# EAGLE design AK-CMSIS-DAP_V1.3 (EAGLE 7.6.0)
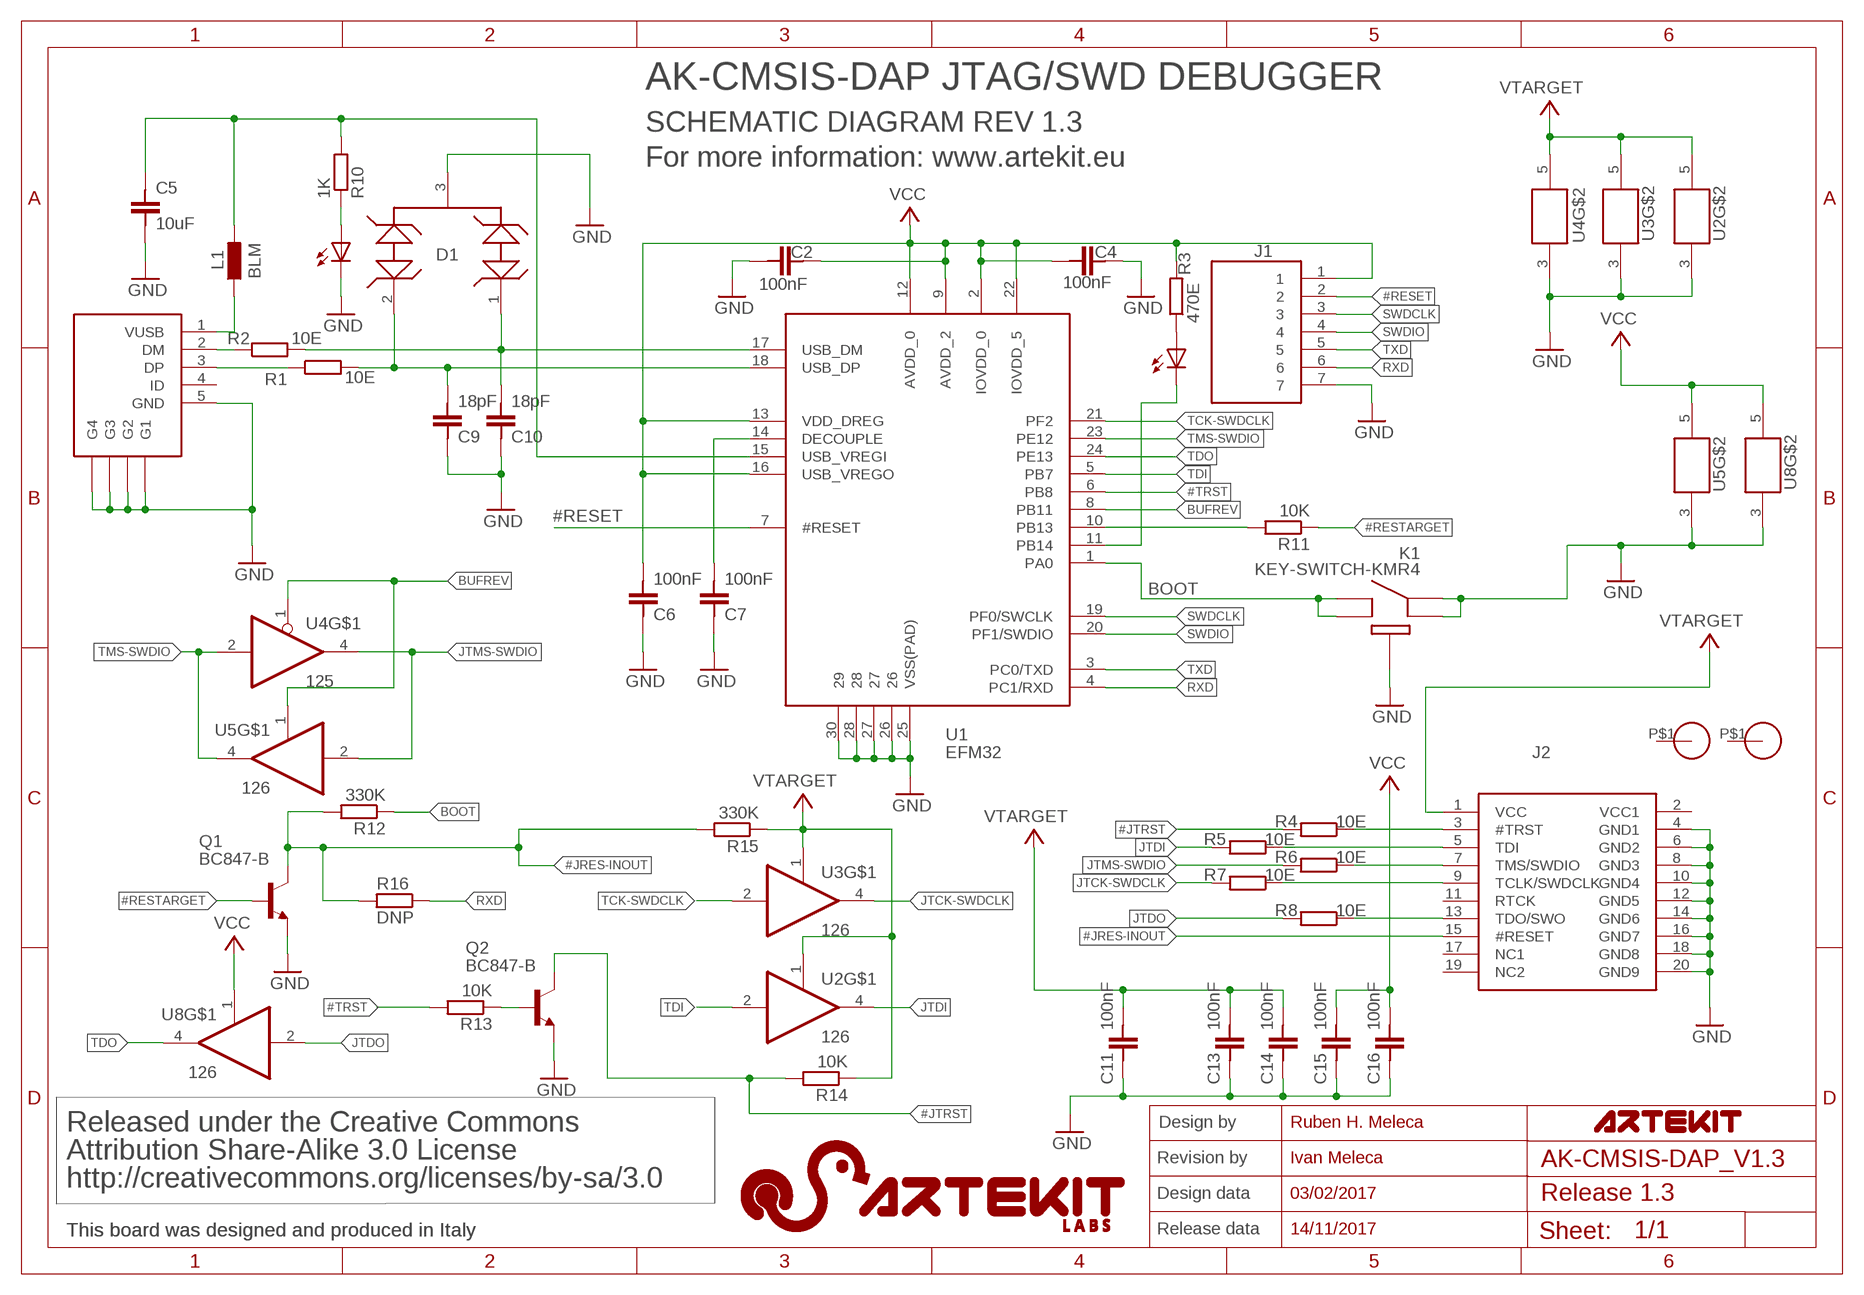
[diagram p0: schematic, sheet 1]

## Parts
C2  100nF  C0603  [C0603]
C4  100nF  C0603  [C0603]
C5  10uF  C0805  [C0805]
C6  100nF  C0603  [C0603]
C7  100nF  C0603  [C0603]
C9  18pF  C0603  [C0603]
C10  18pF  C0603  [C0603]
C11  100nF  C0603  [C0603]
C13  100nF  C0603  [C0603]
C14  100nF  C0603  [C0603]
C15  100nF  C0603  [C0603]
C16  100nF  C0603  [C0603]
D1  D5V0L  D5V0L2B3SO-71  [SOT-23-3]
J1  CON-PH-1X07-P0.1"1  [PIN-HEADER-1X07]
J2  CONN-JTAG-20PIN-SMD  [PIN-HEADER-2X10-WURTH]
K1  KEY-SWITCH-KMR4  [KEY-SWITCH-KMR-SERIES]
L1  BLM  BLM18HD601SN1  [I0603]
Q1  BC847-B  [SOT-23-3]
Q2  BC847-B  [SOT-23-3]
R1  10E  R0603  [R0603]
R2  10E  R0603  [R0603]
R3  470E  R0603  [R0603]
R4  10E  R0603  [R0603]
R5  10E  R0603  [R0603]
R6  10E  R0603  [R0603]
R7  10E  R0603  [R0603]
R8  10E  R0603  [R0603]
R10  1K  R0603  [R0603]
R11  10K  R0603  [R0603]
R12  330K  R0603  [R0603]
R13  10K  R0603  [R0603]
R14  10K  R0603  [R0603]
R15  330K  R0603  [R0603]
R16  DNP  R0603  [R0603]
U1  EFM32  EFM32HG308F64G-A-QFN241  [QFN24-5X5-P0.65]
U2  126  74LVC1G126SOT363-5  [SOT363-5]
U3  126  74LVC1G126SOT363-5  [SOT363-5]
U4  125  74LVC1G125SOT363-5  [SOT363-5]
U5  126  74LVC1G126SOT363-5  [SOT363-5]
U8  126  74LVC1G126SOT363-5  [SOT363-5]
U$1  CON-USB-MINI-B-SMD  [CON-USB-MINI-B-SMD]
U$2  LED0603-RED  [CHIPLED_0603]
U$3  FIDUTIAL_1.2MM  [FIDUTIAL_1.2MM]
U$4  LED0603-RED  [CHIPLED_0603]
U$5  FIDUTIAL_1.2MM  [FIDUTIAL_1.2MM]

## Nets
#JRES-INOUT: J2.15(#RESET) Q1.3 R12.2 R15.2 R16.2
#JTRST: Q2.3 R4.2 R14.2
#RESET: J1.2 U1.7(#RESET)
#RESTARGET: Q1.1 R11.1
#TRST: R13.2 U1.6(PB8)
BOOT: K1.3 K1.4 R12.1 U1.1(PA0)
BUFREV: U1.8(PB11) U4.1(EN) U5.1(EN)
GND: C2.1 C4.2 C5.2 C6.1 C7.1 C9.1 C10.1 C11.1 C13.1 C14.1 C15.1 C16.1 D1.3 J1.7 J2.4(GND1) J2.6(GND2) J2.8(GND3) J2.10(GND4) J2.12(GND5) J2.14(GND6) J2.16(GND7) J2.18(GND8) J2.20(GND9) K1.1 K1.2 K1.5 Q1.2 Q2.2 U1.25(VSS(PAD)) U1.26 U1.27 U1.28 U1.30 U2.3(GND) U3.3(GND) U4.3(GND) U5.3(GND) U8.3(GND) U$1.5(GND) U$1.C(G1) U$1.D(G2) U$1.E(G3) U$1.F(G4) U$2.C
JTCK-SWDCLK: R7.2 U3.4(O)
JTDI: R5.2 U2.4(O)
JTDO: R8.2 U8.2(I)
JTMS-SWDIO: R6.2 U4.4(O) U5.2(I)
N$1: R2.1 U$1.2(DM)
N$2: R1.1 U$1.3(DP)
N$3: C10.2 D1.1 R2.2 U1.17(USB_DM)
N$4: C9.2 D1.2 R1.2 U1.18(USB_DP)
N$5: L1.1 U$1.1(VUSB)
N$6: C5.1 L1.2 R10.2 U1.15(USB_VREGI)
N$7: C7.2 U1.14(DECOUPLE)
N$8: J2.3(#TRST) R4.1
N$9: R3.1 U$4.A
N$10: J2.5(TDI) R5.1
N$11: U1.11(PB14) U$4.C
N$12: J2.7(TMS/SWDIO) R6.1
N$13: J2.9(TCLK/SWDCLK) R7.1
N$14: J2.13(TDO/SWO) R8.1
N$16: R10.1 U$2.A
N$17: R11.2 U1.10(PB13)
N$18: Q2.1 R13.1
RXD: J1.6 R16.1 U1.4(PC1/RXD)
SWDCLK: J1.3 U1.19(PF0/SWCLK)
SWDIO: J1.4 U1.20(PF1/SWDIO)
TCK-SWDCLK: U1.21(PF2) U3.2(I)
TDI: U1.5(PB7) U2.2(I)
TDO: U1.24(PE13) U8.4(O)
TMS-SWDIO: U1.23(PE12) U4.2(I) U5.4(O)
TXD: J1.5 U1.3(PC0/TXD)
VCC: C2.2 C4.1 C6.2 C15.2 C16.2 J1.1 R3.2 U1.2(IOVDD_0) U1.9(AVDD_2) U1.12(AVDD_0) U1.13(VDD_DREG) U1.16(USB_VREGO) U1.22(IOVDD_5) U5.5(VCC) U8.1(EN) U8.5(VCC)
VTARGET: C11.2 C13.2 C14.2 J2.1(VCC) R14.1 R15.1 U2.1(EN) U2.5(VCC) U3.1(EN) U3.5(VCC) U4.5(VCC)
Unconnected: J2.2(VCC1) J2.11(RTCK) J2.17(NC1) J2.19(NC2) U$1.4(ID) U$3.P$1 U$5.P$1

## Notes on the sheet
- AK-CMSIS-DAP JTAG/SWD DEBUGGER
- SCHEMATIC DIAGRAM REV 1.3
- For more information: www.artekit.eu
- Released under the Creative Commons | Design by | Ruben H. Meleca
- Attribution Share-Alike 3.0 License | Revision by | Ivan Meleca
- http://creativecommons.org/licenses/by-sa/3.0
- Design data | 03/02/2017 | Release 1.3
- This board was designed and produced in Italy | This board was designed and produced in Italy | Release data | 14/11/2017

## Library data of the parts
C2 C4 C6 C7 C9-C11 C13-C16 = ak:C0603: CAP SMD 0603 NP; MF: unknown; MPN: unknown
C5 = ak:C0805: CAP SMD 0805 NP; MF: unknown; MPN: unknown
D1 = ak:D5V0L2B3SO-7: TVS Diode 5V Bidir SOT23-5
J1 = ak:CON-PH-1X07-P0.1": CON-Pin Header 1x07 Pitch 0.1"
J2 = ak:CONN-JTAG-20PIN-SMD: JTAG Connector 20-pin P2.54 Right Angle - SMD
K1 = artekit:KEY-SWITCH-KMR4: Key Switch KMR4 series 2.5mm x 4.6mm</b?; MF: C&K Components; MPN: KMR442G ULC LFS; OC_MOUSER: 611-KMR442GULCLFS
L1 = ak:BLM18HD601SN1: EMI Filter Beads, Chips & Arrays 0603 600 OHM; MF: Murata; MPN: BLM18HD601SN1D; OC_MOUSER: 81-BLM11HB601SD
Q1 Q2 = artekit:BC847-B: NPN Bipolar Transistors - 100mA 50V; MF: ON Semiconductors; MPN: BC847BLT1G; OC-DIGIKEY: BC847BLT1GOSCT-ND; OC_FARNELL: 1653607; OC_MOUSER: 863-BC847BLT1G
R1-R8 R10-R15 = ak:R0603: RES SMD 0603; MF: unknown; MPN: unknown
R16 = ak:R0603: RES SMD 0603; ASSY: DNP; MF: unknown; MPN: unknown
U1 = ak:EFM32HG308F64G-A-QFN24: ARM Microcontroller - MCU 64k Flash 8k RAM; MF: Silicon Laboratories; MPN: EFM32HG308F64G-B-QFN24; OC_DIGIKEY: 336-3205-ND; OC_FARNELL: 2475983; OC_MOUSER: 634-EFM32HG308F64GA; OC_NEWARK: 47Y0778; OC_RS: 872-7100
U2 U3 U5 U8 = ak:74LVC1G126: 1 Channel Level Translator & Buffer; MF: Texas; MPN: SN74LVC1G126DCKR; OC_DIGIKEY: 296-11606-1-ND; OC_FARNELL: 2437142; OC_MOUSER: 595-SN74LVC1G126DCKR
U4 = ak:74LVC1G125: 1 Channel Level Translator & Buffer
U$1 = ak:CON-USB-MINI-B-SMD: USB-MINI SMD Connector; MF: EDAC; MPN: 690-005-299-043; OC_MOUSER: 587-690-005-299-043
U$2 U$4 = ak:LED0603-RED: Standard LEDs - SMD Super Red, 633nm 180mcd, 20mA; MF: Osram; MPN: LTST-C191KRKT; OC_DIGIKEY: 475-2512-1-ND; OC_MOUSER: 720-LSQ976-NR-1
U$3 U$5 = artekit:FIDUTIAL_1.2MM

## Net classes
0 default: width 0.2 mm, drill 0.2 mm

## Board
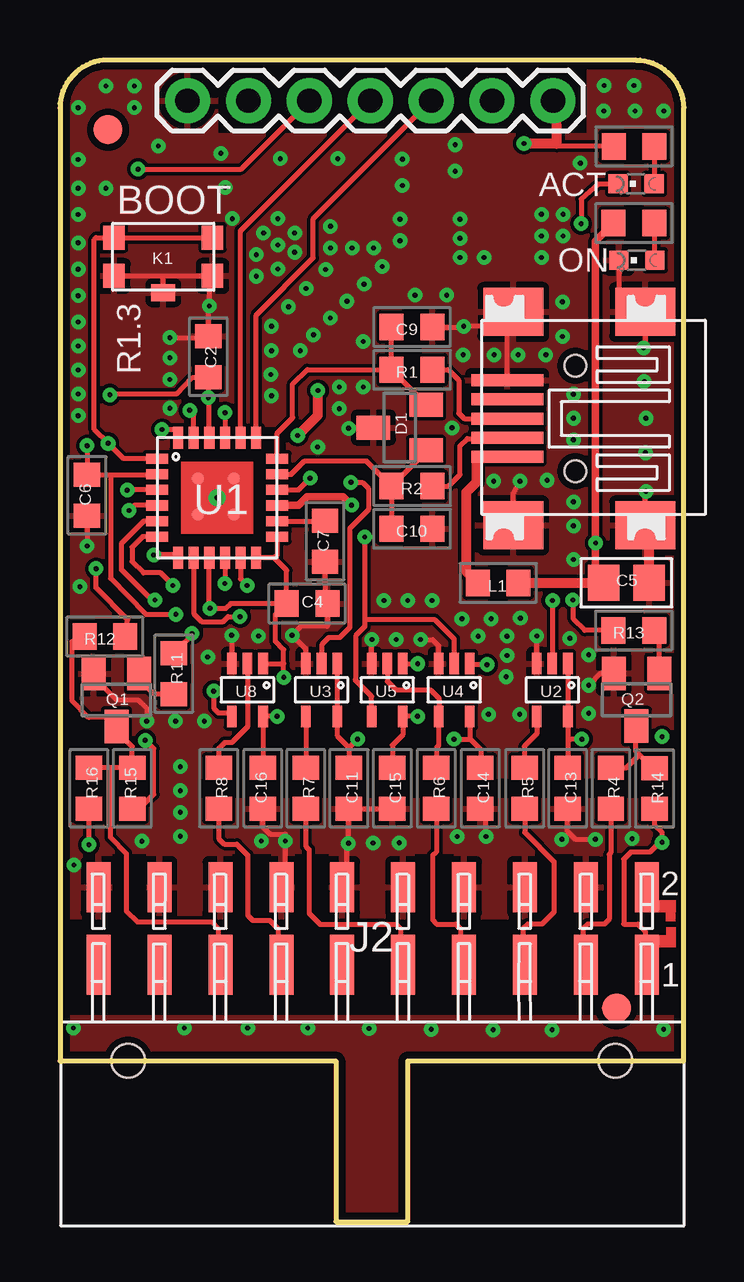
[diagram p1: board, top side]
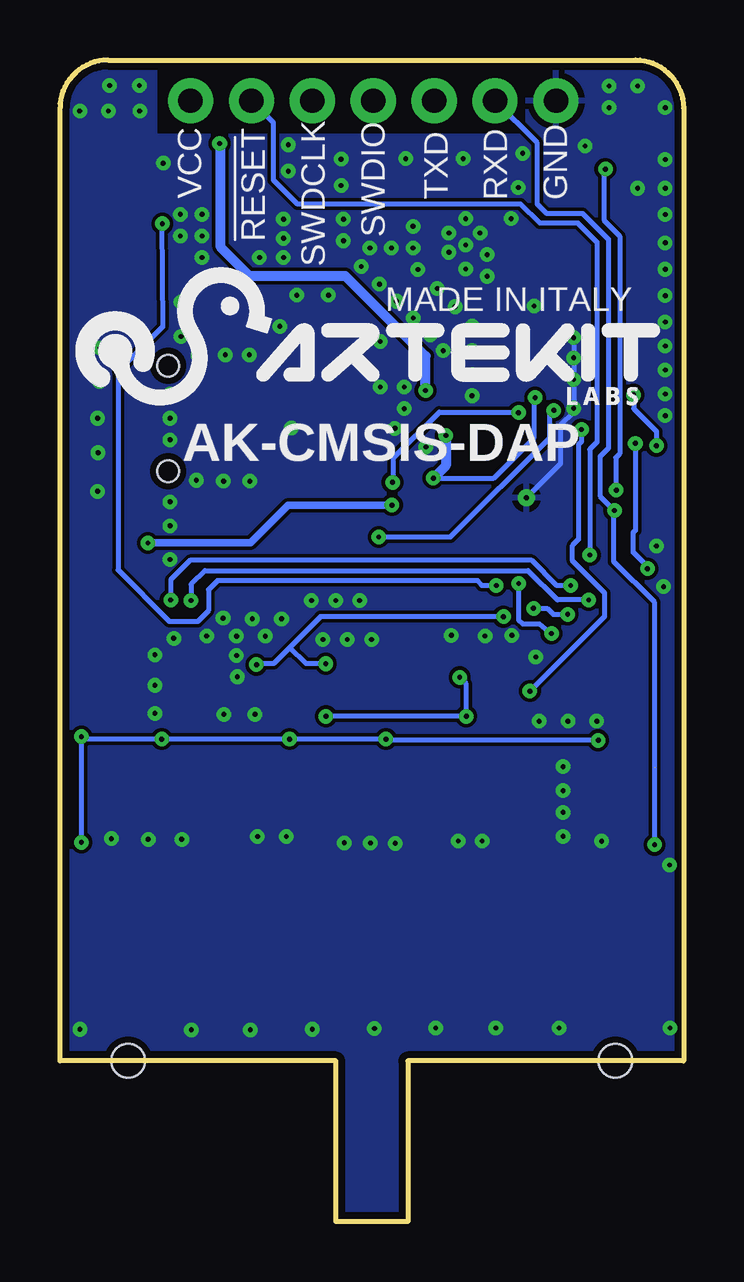
[diagram p2: board, bottom side, seen from below]

Size 26 x 48.4 mm. Coordinates in mm from the lower left corner, seen from the top.
Outline: 0,6.7 11.5,6.7 11.5,0 14.5,0 14.5,6.7 26,6.7 26,46.4 arc90 24,48.4 2,48.4 arc90 0,46.4 0,6.7
Copper layers (1*16): Top 0.035mm / dielectric 1.5mm / Bottom 0.035mm
Design rules "artekit *": minimum track width 0.15mm, minimum drill 0.2mm, track to track 0.15mm, track to pad 0.15mm, pad to pad 0.2mm, via to via 0.15mm, smd to smd 0mil, copper to edge 0.3mm, drill to drill 8mil, minimum pad ring 10mil, minimum via ring 8mil, stop-mask expansion 4mil, vias tented up to drill 15mil, thermal gap 10mil
tRestrict: area 8.4,32.2 to 9.4,33.1; area 6.6,45.4 to 22,48; area 23.6,39.7 to 24.6,40.4; area 0.4,8.6 to 25.6,12.6; area 23.3,12.3 to 25.6,15.3; area 19.8,12.7 to 21.4,15.3; area 14.8,12.7 to 16.4,15.3; area 7.2,12.5 to 8.8,15.3; area 2.2,12.7 to 3.6,15.3; area 9.8,12.5 to 11.2,15.3
bRestrict: area 6.6,45.4 to 21.9,48

### Footprints (pad centres in the part's own frame; a part is rotated, then mirrored left to right if it is on the bottom)
C0603 = smd 1 x 1.1: 1 -0.85,0; 2 0.85,0
C0805 = smd 1.3 x 1.5: 1 -0.99,0; 2 0.91,0
SOT-23-3 = smd 1 x 1.4: 1 -0.95,-1.1; 2 0.95,-1.1; 3 0,1.1
PIN-HEADER-1X07 = drill 1.016 pad 1.88: 1 0,0; 2 2.54,0; 3 5.08,0; 4 7.62,0; 5 10.16,0; 6 12.7,0; 7 15.24,0
PIN-HEADER-2X10-WURTH = smd 1 x 2.5: 1 -11.47,3.13; 3 -8.93,3.13; 5 -6.39,3.13; 7 -3.85,3.13; 9 -1.31,3.13; 11 1.23,3.13; 13 3.77,3.13; 15 6.31,3.13; 17 8.85,3.13; 19 11.39,3.13 | smd 1 x 2.1: 2 -11.47,-0.1; 4 -8.93,-0.1; 6 -6.39,-0.1; 8 -3.85,-0.1; 10 -1.31,-0.1; 12 1.23,-0.1; 14 3.77,-0.1; 16 6.31,-0.1; 18 8.85,-0.1; 20 11.39,-0.1 | hole 1.4: 10.16,7.14; -10.16,7.14
KEY-SWITCH-KMR-SERIES = smd 0.9 x 1: 1 -2.05,0.8; 2 2.05,0.8; 3 2.05,-0.8; 4 -2.05,-0.8 | smd 1 x 0.7: 5 0,1.5
I0603 = smd 1 x 1.1: 1 -0.85,0; 2 0.85,0
R0603 = smd 1 x 1.1: 1 -0.85,0; 2 0.85,0
QFN24-5X5-P0.65 = smd 0.92 x 0.42: 1 -2.5,1.625; 2 -2.5,0.975; 3 -2.5,0.325; 4 -2.5,-0.325; 5 -2.5,-0.975; 6 -2.5,-1.625; 13 2.5,-1.625; 14 2.5,-0.975; 15 2.5,-0.325; 16 2.5,0.325; 17 2.5,0.975; 18 2.5,1.625 | smd 0.42 x 0.92: 7 -1.625,-2.5; 8 -0.975,-2.5; 9 -0.325,-2.5; 10 0.325,-2.5; 11 0.975,-2.5; 12 1.625,-2.5; 19 1.625,2.5; 20 0.975,2.5; 21 0.325,2.5; 22 -0.325,2.5; 23 -0.975,2.5; 24 -1.625,2.5 | smd 0.5 x 0.5: 25 -0.8,0.8; 26 -0.8,-0.7; 27 0.7,-0.7; 28 0.7,0.8 | drill 0.2: 30 0,0
SOT363-5 = smd 0.4 x 0.9: 1 -0.65,-1.1; 2 0,-1.1; 3 0.65,-1.1; 4 0.65,1.1; 5 -0.65,1.1
CON-USB-MINI-B-SMD = smd 0.5 x 3: 1 -1.6,0.25; 2 -0.8,0.25; 3 0,0.25; 4 0.8,0.25; 5 1.6,0.25 | smd 2 x 2.5: C -4.45,0; D 4.45,0; E -4.45,-5.5; F 4.45,-5.5 | hole 0.9: -2.2,-2.6; 2.2,-2.6
CHIPLED_0603 = smd 0.8 x 0.8: A 0,-0.75; C 0,0.75
FIDUTIAL_1.2MM = smd 1.2 x 1.2: P$1 0,0

### Placement (x,y rotation side)
C2  6.19,36.03 270 top
C4  10.3,25.75 0 top
C5  23.65,26.61 0 top
C6  1.13,30.26 90 top
C7  11.05,28.34 90 top
C9  14.68,37.27 180 top
C10  14.68,28.87 180 top
C11  12.05,18.05 90 top
C13  21.17,18.05 90 top
C14  17.53,18.05 90 top
C15  13.86,18.05 90 top
C16  8.46,18.05 90 top
D1  14.17,33.08 90 top
J1  20.56,46.7 180 top
J2  13,13.83 180 top
K1  4.31,40.2 180 top
L1  18.27,26.61 0 top
Q1  2.36,21.73 180 top
Q2  24.04,21.74 180 top
R1  14.68,35.49 180 top
R2  14.68,30.64 180 top
R3  23.94,44.8 180 top
R4  22.97,18.06 90 top
R5  19.38,18.06 90 top
R6  15.69,18.06 90 top
R7  10.25,18.06 90 top
R8  6.62,18.06 90 top
R10  23.93,41.6 180 top
R11  4.75,22.82 90 top
R12  1.88,24.38 180 top
R13  23.93,24.63 180 top
R14  24.79,18.05 90 top
R15  3.02,18.06 90 top
R16  1.21,18.06 90 top
U1  6.55,30.16 0 top
U2  20.53,22.15 180 top
U3  10.91,22.15 180 top
U4  16.44,22.15 180 top
U5  13.65,22.15 180 top
U8  7.82,22.15 180 top
U$1  18.9,33.46 90 top
U$2  24.06,40.05 90 top
U$3  2,45.5 0 top
U$4  24.02,43.24 90 top
U$5  23.2,8.9 0 top

### Tracks (layer width: path | path; a pad name or v marks a point on that pad's centre or on a via)
#JRES-INOUT  (1 unrouted)
  Top 0.2: Q1.3 2.34,20.73 | Q1.3 2.36,21 1.21,21 0.51,21.7 0.51,24.16 R12.2 | Q1.3 2.71,20.38 2.71,20.1 3.02,19.79 R15.2 2.98,18.94 2.01,18.94 | 1.21,18.94 2.01,18.94 | 2.01,18.94 2.11,18.84 2.11,16 2.77,15.34 2.77,12.95 3.23,12.48 6.32,12.48 6.6,12.2 6.6,10.72 J2.15
#JTRST
  Top 0.2: R14.2 24.72,18.9 24.16,19.45 | 24.16,19.45 24.01,19.6 24.01,20.61 Q2.3 | R4.2 23.61,18.91 24.16,19.45
#RESET  (via drill 0.2)
  Top 0.2: U1.7 4.97,27.78 v3.91,27.78
  Bottom 0.2: 3.92,27.7 v3.91,27.78 3.91,32.18 3.61,32.48 3.61,40.81 4.4,41.6 6,41.6 6.8,42.4 16.1,42.4 17.1,43.4 17.1,45.79 J1.2 18,46.69
#RESTARGET
  Top 0.2: Q1.1 3.31,22.6 3.91,22 4.71,22 R11.1
#TRST  (via drill 0.2)
  Top 0.2: U1.6 3.44,28.54 3.01,28.1 3.01,27.5 3.48,27.03 4.21,27.03 4.71,26.53 v4.71,26.5 | R13.2 21.88,24.63 21.41,25.1 21.41,25.88 v21.38,25.9
  Bottom 0.2: v4.71,26.5 5.28,26.5 6.33,27.55 20.58,27.55 21.38,26.75 v21.38,25.9
BOOT  (via drill 0.2)
  Top 0.2: U1.1 2.65,31.79 v2.01,32.43 1.43,33 1.43,40.93 1.51,41 K1.3 K1.4 | R12.1 2.83,25.09 1.51,26.4 v1.51,27.2
  Bottom 0.2: v1.51,27.2 1.51,27.3 2.11,27.9 2.11,28.7 2.01,28.8 v2.01,32.43
BUFREV  (via drill 0.2)
  Top 0.2: U1.8 5.58,25.33 5.91,25 6.81,25 7.01,25.2 v7.51,25.2 | v17.81,23.2 17.14,23.2 U4.1 | U5.1 14.91,23.25 v14.92,23.24
  Bottom 0.2: v7.51,25.2 15.14,25.2 16.42,23.92 | 16.42,23.92 U4.1 17.76,23.25 v17.81,23.2 | v14.92,23.24 15.75,23.24 16.42,23.92
GND  (via drill 0.2)
  Top 0.2: C15.1 C11.1 12.03,17.19 v12.03,15.76 11.95,15.7 11.96,14.35 | U8.3 7.17,24.42 v7.16,24.43 | U3.3 10.26,23.85 v9.68,24.43 | U5.3 13,24.21 v13.01,24.25 | 15.79,23.67 U4.3 15.78,24 15.53,24.25 v15.03,24.25 | U2.3 19.88,23.71 v19.88,24.4 | C7.1 11.05,25.85 C4.2 11.15,24.82 11.13,24.8 10.06,24.8 v9.68,24.43 | U1.27 U1.28 | U1.30 U1.25 | U1.26 5.85,29.46 U1.30 | U1.27 U1.30 | U1.27 7.25,30.8 7.28,30.83 7.23,30.83 6.58,30.18 | C6.1 v1.13,28.16 v1.13,28.15 | C2.1 6.19,38.11 v6.23,38.15 6.23,39.28 K1.1 4.31,39.4 | C9.1 16.8,37.27 v16.83,37.3 18.03,37.3 18.39,37.66 18.65,37.66 | D1.3 12.06,33.08 v12.03,33.05 | U$1.5 18.65,37.66 | 18.65,37.66 U$1.D | v24.33,36.4 24.4,36.47 U$1.F 24.1,37.91 23.33,38.68 23.33,39.53 U$2.C | U$1.E 24.4,30.39 v24.43,30.43 | U$1.C 18.9,30.34 v19.18,30.85 | 5.97,37.1 C2.1 | C14.1 17.77,16.97 v17.77,16.04 | v4.58,36.83 6.13,36.83 C2.1 | v9.68,24.43 9.73,24.43 9.76,24.45 | C13.1 21.15,17.19 21.15,16.27 21.49,15.93 v22.32,15.93 | Q1.2 1.41,22.7 2.34,21.74 3.26,21.73 3.61,21.4 3.61,20.86 v3.62,20.85 | Q2.2 22.54,22.84 v22.04,22.35 | K1.2 4.31,39.4 | K1.5 4.31,39.4 | C16.1 8.46,16.45 8.76,16.15 9.39,16.15 | 9.39,16.15 v9.4,15.86 | 9.39,16.15 9.39,14.32
  Top 0.406: C5.2 24.56,28.84 U$1.E
  Bottom 0.2: v4.58,36.83 4.58,33.73 5.13,33.18 5.13,31.58 U1.30
  other vias: 23.86,15.95 22.69,47.34 11.59,44.29 1.92,47.31 3.1,47.31 0.77,44.25 0.77,43.06 0.77,41.96 23.93,47.34 25.18,46.27 8.79,35.3 8.82,36.29 8.82,37.31 9.53,38.12 10.27,38.88 11.08,39.67 8.82,34.41 11.97,38.35 12.68,39.06 13.44,39.79 8.28,24.4 14.02,24.25 13.51,25.88 14.5,25.88 15.52,25.88 16.76,25.12 17.98,25.12 19.2,25.14 21.26,24.3 22.04,21.18 22.04,23.62 19.17,21.13 18.61,22.7 18.64,23.59 24.43,33.47 21.41,33.47 21.41,29.99 16.81,36.11 18.11,36.11 20.26,36.11 20.95,36.88 24.36,35.01 24.41,32.04 20.95,38.32 14.8,38.6 16.13,38.6 12.65,36.67 9.19,44.29 9.09,41.79 8.49,41.19 8.19,40.29 8.19,39.39 9.09,39.69 9.79,40.39 9.79,41.19 9.09,40.69 4.59,35.99 4.59,35.09 0.77,33.58 0.77,34.48 0.77,35.48 0.77,36.48 0.77,37.48 0.77,38.58 0.77,39.68 0.77,40.78 11.28,40.57 11.28,41.47 12.18,40.57 13.08,40.57 14.18,41.77 14.18,40.87 16.68,40.97 16.68,41.77 16.68,40.17 17.68,40.17 20.08,41.97 20.08,41.07 20.08,40.17 14.28,44.27 14.28,43.17 21.69,44.1 6.89,43.09 3.1,46.41 4.1,44.81 11.65,34.77 12.65,34.77 11.27,37.65 10.57,36.95 10.02,36.29 11.65,33.87 16.35,33.07 23.98,46.27 22.68,46.27 20.98,41.07 20.98,41.97 4.59,33.89 0.83,26.45 21.41,28.99 20.31,30.89 21.41,27.59 21.41,32.57 21.41,34.47 18.64,24.39 17.44,24.39 4.82,20.85 6.02,20.85 5.02,17.05 3.42,15.85 0.58,14.86 6.16,23.53 0.77,46.41 6.7,44.51 7.19,41.79 1.92,43.06 18.08,30.85 19.11,36.11 0.56,8.07 5.18,8.07 7.83,8.07 10.33,8.07 12.89,8.04 15.48,8.01 18.06,7.99 20.52,7.99 25.17,8.01 17.87,21.13 5.02,17.95 5.02,18.95 5.02,16.05 13.05,15.77 14.14,15.78 8.4,15.86 16.57,16.04 20.92,15.93 16.48,44.87 16.48,43.77 10.75,32.27
  pour Top: -1.09,49.3 -0.96,-1.83 27.34,-1.83 27.21,49.48 -1.14,49.48 -1.14,49.38
  pour Bottom: -1.84,50.18 -1.94,50.18 -1.97,-2.41 28.06,-2.41 28.08,50.23 -1.89,50.23
JTCK-SWDCLK
  Top 0.2: U3.4 R7.2
JTDI
  Top 0.2: U2.4 19.88,20.32 19.36,19.8 19.36,18.93 R5.2
JTDO
  Top 0.2: U8.2 7.82,20.61 7.16,19.95 6.86,19.95 6.61,19.7 6.61,18.92 R8.2
JTMS-SWDIO
  Top 0.2: R6.2 15.71,18.93 15.71,19.75 15.79,19.83 U4.4 15.81,21.07 15.81,21.8 15.46,22.15 14.01,22.15 13.65,22.51 U5.2
N$1
  Top 0.2: R2.1 16.2,30.64 16.68,31.13 16.68,32.33 16.98,32.63 18.62,32.63 U$1.2
N$2
  Top 0.2: R1.1 16.19,35.49 16.63,35.05 16.63,33.68 16.86,33.45 U$1.3
N$3
  Top 0.2: D1.1 15.27,32.08 R2.2 | 13.82,30.65 R2.2 | R2.2 C10.2 | U1.17 9.64,31.14 10.2,31.7 12.79,31.7 12.79,31.69 R2.2
N$4
  Top 0.2: D1.2 15.27,34.06 R1.2 | R1.2 C9.2 | U1.18 9.05,32.85 9.71,33.5 9.71,34.9 10.31,35.5 13.82,35.5 R1.2
N$5
  Top 0.406: U$1.1 17.36,31.86 17.36,31.85 17.36,30.8 16.93,30.38 16.93,27.1 L1.1
N$6  (via drill 0.2)
  Top 0.305: C5.1 22.33,26.94 v22.33,28.28 22.33,40.85 R10.2 | U1.15 9.94,29.84 10.3,30.2 11.81,30.2 v12.16,29.85
  Top 0.406: L1.2 C5.1
  Bottom 0.305: v12.16,29.85 16.48,29.85 18.06,28.28 v22.33,28.28
N$7
  Top 0.2: U1.14 C7.2
N$8
  Top 0.2: J2.3 21.8,10.73 21.8,12.2 22,12.4 22.7,12.4 22.9,12.6 22.9,15.3 22.97,15.37 R4.1
N$9
  Top 0.2: R3.1 24.79,43.26 U$4.A
N$10
  Top 0.2: R5.1 19.38,16.22 20.6,15 20.6,12.9 20.1,12.4 19.5,12.4 19.3,12.2 19.3,10.72 J2.5
N$11  (via drill 0.2)
  Top 0.2: U1.11 7.53,26.78 v7.81,26.5 | U$4.C 23.26,43.23 22.46,43.23 21.73,42.6 v21.73,41.58
  Bottom 0.2: v7.81,26.5 8.41,26.5 8.58,26.7 19.43,26.7 19.81,26.33 19.81,25.45 20.26,25 21.43,25 23.58,27.15 23.58,35.43 21.71,37.3 v21.73,41.58
N$12
  Top 0.2: R6.1 15.69,15.4 15.53,15.24 15.53,12.57 15.7,12.4 16.5,12.4 16.7,12.2 16.7,10.75 J2.7
N$13
  Top 0.2: R7.1 10.25,15.64 10.39,15.5 10.39,12.84 10.85,12.38 14.02,12.38 14.2,12.2 14.2,10.71 J2.9
N$14
  Top 0.2: R8.1 6.62,15.95 6.84,15.73 7.37,15.73 7.83,15.27 7.83,12.76 8.03,12.56 8.74,12.56 9.1,12.2 9.1,10.73 J2.13
N$16
  Top 0.2: R10.1 24.78,40.08 U$2.A
N$17  (via drill 0.2)
  Top 0.2: U1.10 v6.88,26.58 | v5.51,24.5 5.67,24.6 R11.2
  Bottom 0.2: v6.88,26.58 6.88,25.07 6.71,24.9 6.01,24.9 v5.51,24.5
N$18
  Top 0.2: Q2.1 24.99,24.42 R13.1
RXD  (via drill 0.2)
  Top 0.2: U1.4 3.09,29.84 v2.88,29.63 | R16.1 v1.21,15.7
  Bottom 0.2: v2.88,29.63 2.88,29.65 | v2.88,29.63 3.48,30.23 3.48,31.88 3.13,32.23 3.13,40.93 4.2,42 5.7,42 6.1,42.4 6.1,44.95 J1.6 | v1.21,15.7 1.21,25.8 2.91,27.5 2.91,29.6 v2.88,29.63
SWDCLK
  Top 0.2: U1.19 8.18,37.77 10.56,40.15 10.56,41.78 J1.3
SWDIO
  Top 0.2: U1.20 7.53,41.29 J1.4
TCK-SWDCLK  (via drill 0.2)
  Top 0.2: v6.88,33.7 U1.21 | v12.13,30.8 12.61,30.8 12.86,30.55 12.86,29.65 12.08,28.88 12.08,24.75 11.66,24.33 11.21,24.33 10.91,24.03 U3.2
  Bottom 0.2: v6.88,33.7 6.91,33.73 10.18,33.73 12.11,31.8 12.11,30.73 v12.13,30.8
TDI  (via drill 0.2)
  Top 0.2: U1.5 3.49,29.19 2.56,28.25 2.56,27.18 3.83,25.9 v3.96,25.9 | v20.53,25.88 U2.2
  Bottom 0.2: v3.96,25.9 5.26,25.9 6.48,27.13 19.96,27.13 20.53,26.55 v20.53,25.88
TDO  (via drill 0.2)
  Top 0.2: U1.24 4.93,32.98 v4.26,33 | 7.16,21.06 U8.4 7.02,21.2 6.6,21.2 6.41,21.39 v6.41,22.1
  Bottom 0.2: v4.26,33 4.26,32.5 4.38,32.38 4.38,28.43 4.63,28.18 4.63,27.53 3.91,26.8 3.9,26.8 3.3,26.2 3.3,25.21 v6.41,22.1
TMS-SWDIO  (via drill 0.2)
  Top 0.2: U1.23 5.58,33.63 v5.41,33.8 | U4.2 16.43,24.28 15.63,25.08 12.76,25.08 12.71,25.13 | U5.4 13,21.89 12.31,22.58 12.33,22.6 12.33,24.4 12.71,24.78 12.71,25.13 | v12.71,28.53 12.71,25.13
  Bottom 0.2: v12.71,28.53 9.71,28.53 U1.23 5.58,33.63 v5.41,33.8
TXD  (via drill 0.2)
  Top 0.2: U1.3 v2.82,30.49 v2.81,30.48 | J1.5 7.55,43.85 v3.26,43.85
  Bottom 0.2: v2.81,30.48 2.83,30.5 2.83,31.83 2.66,32 2.66,41.06 3.3,41.7 3.3,43.81 v3.26,43.85
VCC  (via drill 0.2)
  Top 0.2: C16.2 8.47,18.91 U8.5 v9.06,21.05 | C15.2 13.86,19.85 14.3,20.29 U5.5 v14.91,21.05 | U1.13 9.05,27.77 8.93,27.65 | 8.93,27.65 U1.12 | C4.1 9.45,27.14 8.93,27.65 | C4.1 7.11,25.75 6.91,25.55 v6.26,25.55 6.23,25.55 U1.9 | 2.11,31.11 C6.2 v1.13,32.33 | 2.11,31.11 4.03,31.11 U1.2 | 2.11,31.11 2.11,26.8 3.58,25.3 v4.83,25.3 | U1.22 6.19,32.7 v6.19,34.33 C2.2 5.53,35.18 4.86,34.48 1.91,34.48 v2.08,34.45 | U1.16 9.95,30.49 v10.43,30.98 | v9.33,22.68 9.33,23.25 | 9.33,23.25 9.33,23.83 8.98,24.18 8.98,25.29 C4.1 | R3.2 20.71,44.8 20.72,44.93 | U8.1 9.33,23.25
  Top 0.406: v10.76,34.63 10.76,33.6 v9.91,32.75 | v19.34,44.92 20.72,44.93 20.71,46.55 J1.1
  Bottom 0.2: v14.91,21.05 v9.06,21.05 9.06,22.4 v9.33,22.68 | v10.43,30.98 7.91,30.98 U1.22 6.23,34.29 v6.19,34.33 | v2.08,34.45 2.08,33.88 1.13,32.93 v1.13,32.33 | v6.26,25.55 5.68,25.55 5.43,25.3 v4.83,25.3
  Bottom 0.406: v10.76,34.63 10.76,36.06 14.1,39.4 18.1,39.4 19.3,40.6 19.3,44.88 v19.34,44.92 | v9.91,32.75 9.91,31.5 v10.43,30.98
VTARGET  (via drill 0.2)
  Top 0.2: 25.06,20.15 v25.11,20.2 | 12.06,19.75 11.56,20.25 U3.5 U3.1 | 12.06,19.75 12.06,18.91 C11.2 | U4.5 17.09,20.12 | 17.09,20.12 17.56,19.65 17.56,18.93 C14.2 | 21.18,20 U2.5 U2.1 | 21.18,20 21.18,18.91 C13.2 | 3.55,20.04 v3.56,20.05 3.91,19.7 3.91,17.8 3.31,17.21 R15.1 | v12.41,20.1 12.06,19.75 | v21.76,20.1 21.28,20.1 21.18,20 | R14.1 24.81,17.18 24.81,16.5 25.11,16.2 v25.11,15.8 25.1,15.79 24.99,15.79 24.6,15.4 23.8,15.4 23.5,15.1 23.5,12.4 24.1,12.4 24.4,12.1 24.4,10.74 J2.1 24.36,10.7 | v16.43,20.1 17.09,20.1 17.09,20.12
  Bottom 0.2: 25.06,20.15 v25.11,20.2 | v3.56,20.05 12.36,20.05 v12.41,20.1 v16.43,20.1 v21.76,20.1 | 21.71,20.05 v21.76,20.1 | v21.76,20.1 25.01,20.1 v25.11,20.2 | v25.11,20.2 v25.11,15.8
(copper drawn outside any net)
  shapes: Top area x4

### Text on the board
tPlace: ACT | BOOT | ON | R1.3 | 2 | 1
bPlace: GND | RXD | TXD | VCC | SWDIO | RESET | SWDCLK | MADE IN ITALY | AK-CMSIS-DAP
Measures: All dimensions are in millimeters